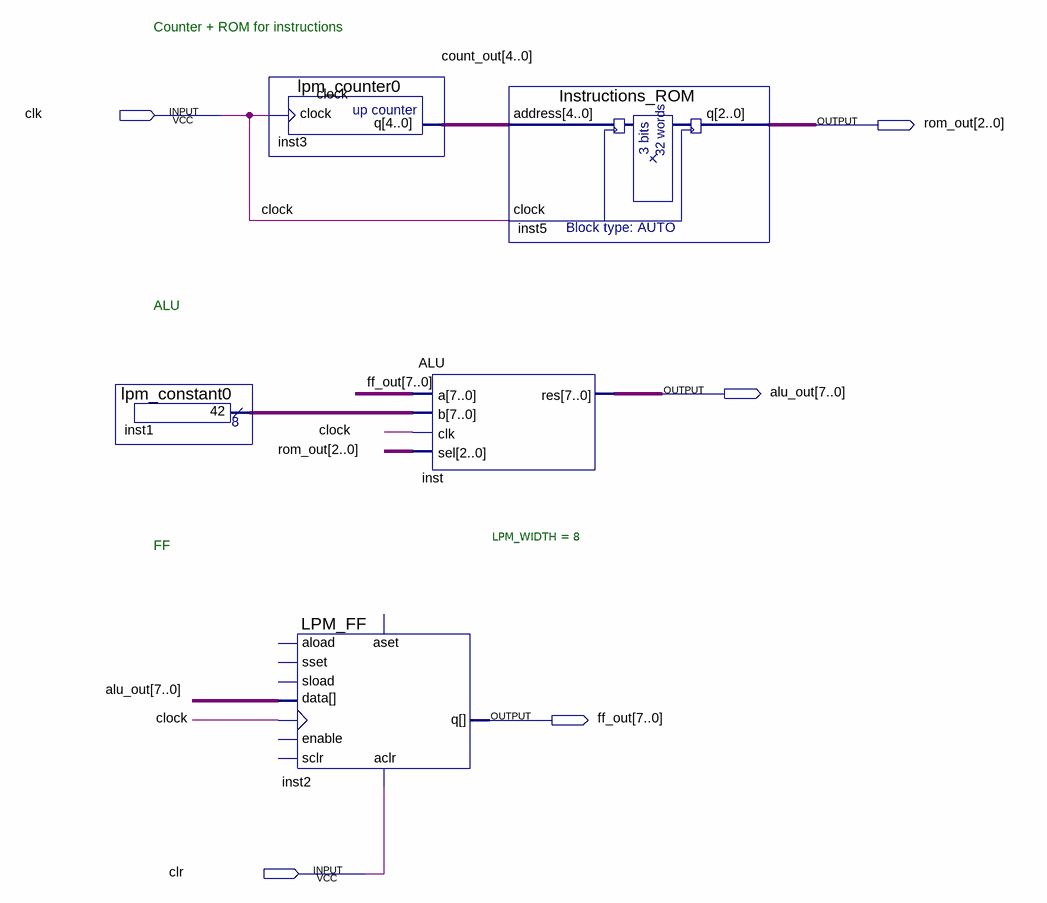
[diagram p0: schematic sheet]
// Quartus schematic Schematic.bdf as structural Verilog: 5 symbols, 5 pins
module Schematic (
  input  clk,
  input  clr,
  output [2:0] rom_out,
  output [7:0] alu_out,
  output [7:0] ff_out
);

  wire [4:0] count_out;
  wire [7:0] inst1_result;

  lpm_constant0 inst1 (.result(inst1_result));
  lpm_counter0 inst3 (.clock(clk), .q(count_out));
  LPM_FF #(.LPM_WIDTH(8)) inst2 (
    .clock(clk), .aclr(clr), .data(alu_out), .q(ff_out));  // open: enable, aload, sset, sload, aset, sclr
  ALU inst (.a(ff_out), .b(inst1_result), .clk(clk), .sel(rom_out), .res(alu_out));
  Instructions_ROM inst5 (.address(count_out), .clock(clk), .q(rom_out));

  // Other names for the same wires on the sheet: clock = clk

  // Notes on the sheet:
  //   Counter + ROM for instructions
  //   ALU
  //   FF
endmodule
